# EAGLE design Adafruit NeoKey CHOC Socket Breakout (EAGLE 9.6.2)
COMPANY: ADAFRUIT INDUSTRIES; DRAWN: KTOWN; REV: A
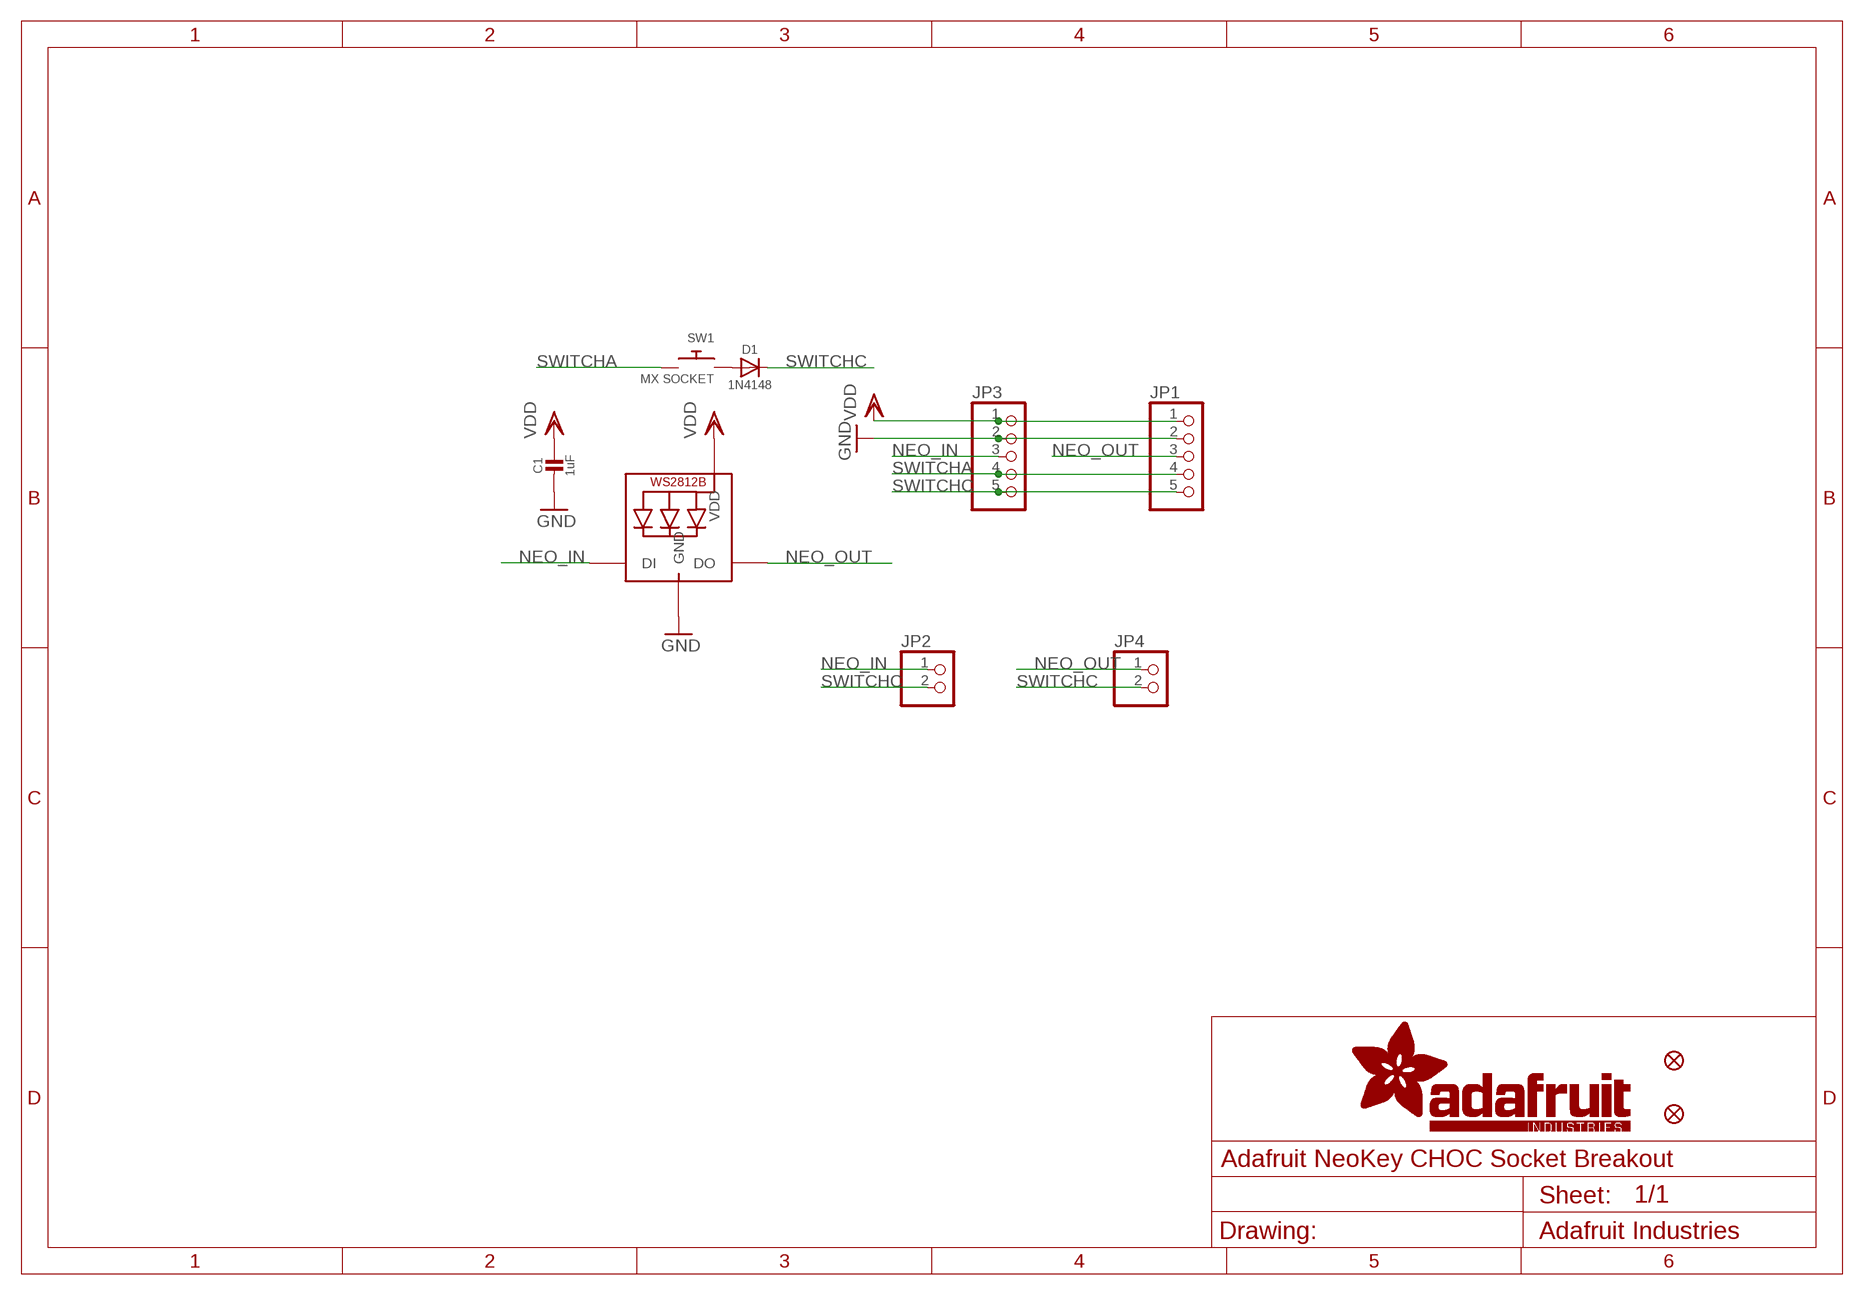
[diagram p0: schematic, sheet 1]

## Parts
C1  1uF  CAP_CERAMIC0603_NO  [0603-NO]
D1  1N4148  DIODESOD-323  [SOD-323]
FID3  FIDUCIAL_1MM  [FIDUCIAL_1MM]
FID4  FIDUCIAL_1MM  [FIDUCIAL_1MM]
JP1  HEADER-1X570MIL  [1X05_ROUND_70]
JP2  HEADER-1X2ROUND  [1X02_ROUND]
JP3  HEADER-1X570MIL  [1X05_ROUND_70]
JP4  HEADER-1X2ROUND  [1X02_ROUND]
LED1  WS2812B_SK6812E  [NEO3535_REVERSE]
SW1  MX SOCKET  SWITCH_PUSHBUTTON_CHOCSOCKET  [KAILH_CHOC_SOCKET]

## Nets
GND: C1.2 JP1.2 JP3.2 LED1.3-GND(GND)
N$2: D1.A SW1.1
NEO_IN: JP2.1 JP3.3 LED1.4-DIN(DI)
NEO_OUT: JP1.3 JP4.1 LED1.2-DOUT(DO)
SWITCHA: JP1.4 JP3.4 SW1.2
SWITCHC: D1.C JP1.5 JP2.2 JP3.5 JP4.2
VDD: C1.1 JP1.1 JP3.1 LED1.1-VDD(VDD)

## Library data of the parts
C1 = microbuilder:CAP_CERAMIC: Ceramic Capacitors For new designs, use the packages preceded by an '_' character since they are more reliable: The following footprints should be used on most boards: _0402 - Standard footprint for regular board layouts _0603 - Standard footprint for regular board layouts _0805 - Standard footprint for regular board layouts _1206 - Standard footprint for regular board layouts For extremely tight-pitch boards where space is at a premium, the following 'micro-pitch' footprints can be used (smaller pads, no silkscreen outline, etc.): _0402MP - Micro-pitch footprint for very dense/compact boards _0603MP - Micro-pitch footprint for very dense/compact boards _0805MP - Micro-pitch footprint for very dense/compact boards _1206MP - Micro-pitch footprint for very dense/compact boards
D1 = microbuilder:DIODE: Diode SMA Model Volts Amps Type Vf Ir Digikey # Notes SSA34-E3 40V 3A Schottky 480mV @ 3A 200uA @ 40V SSA34-E3/61TGITR-ND CDBA120-G 20V 1A Schottky 500mV @ 1A 500uA @ 20V 641-1014-6-ND REEL MBRA210 10V 2A Schottky 350mV @ 2A 700uA @ 10V MBRA210LT3 SOD-123 Model Volts Amps Type Vf Ir Order # Notes BAT54T1G 30V 200mA Schottky 800mV @ 200mA 2uA @ 25V BAT54T1GOSTR-ND B0530W 30V 500mA Schottky 430mV @ 500mA 130uA @ 30V B0530W-FDICT-ND REEL MBR120 20V 1A Schottky 340mV @ 1A MBR120VLSFT1GOSCT-ND SOD-323 Model Volts Amps Type Vf Ir Order # Notes PMEG2005EJ 20V 500mA Schottky 355mV @ 500mA 568-4110-1-ND ZLLS410 10V 570mA Schottky 380mV @ 570mA ZLLS410CT-ND 1N4148WS 75V 150mA Silicon/Simple 1V 1N4148WSFSCT-ND REEL SOD-523 Model Volts Amps Type Vf Ir Order # Notes BAT54XV2 30V 200mA Schottky 0.8V @ 100mA BAT54XV2CT-ND TB751S 30V 30mA Schottky RB751S-40TE61CT-ND SOT23-R/W (R = Solder Paste/Reflow Ovens, W = Hand-Soldering) Model Volts Amps Type Vf Ir Order # Notes BAT54FILM 40V 300mA Schottky 497-7162-1-ND POWERDI-5 Model Volts Amps Type Vf Ir Order # Notes PDS560 60V 5A Schottky 670mV @ 5A 150uA @ 60V PDS560DICT-ND
FID3 FID4 = microbuilder:FIDUCIAL: Fiducial Alignment Points Various fiducial points for machine vision alignment.; BOM: EXCLUDE
JP1 JP3 = microbuilder:HEADER-1X5: PIN HEADER
JP2 JP4 = microbuilder:HEADER-1X2: PIN HEADER
LED1 = microbuilder:WS2812B
SW1 = adafruit_electromech:SWITCH_PUSHBUTTON: Buttons SOFTTOUCHSMD_SJ - Soft touch temporary push button (Super Junk Akihabara) Compatible with SKPMANE010 [Mouser: 688-SKPMAN] C&K_KSS = Digikey: KSS221GLFS

## Net classes
1 highpower: width 0.305 mm, drill 0.483 mm
2 lowpower: width 0.254 mm, drill 0.483 mm

## Board
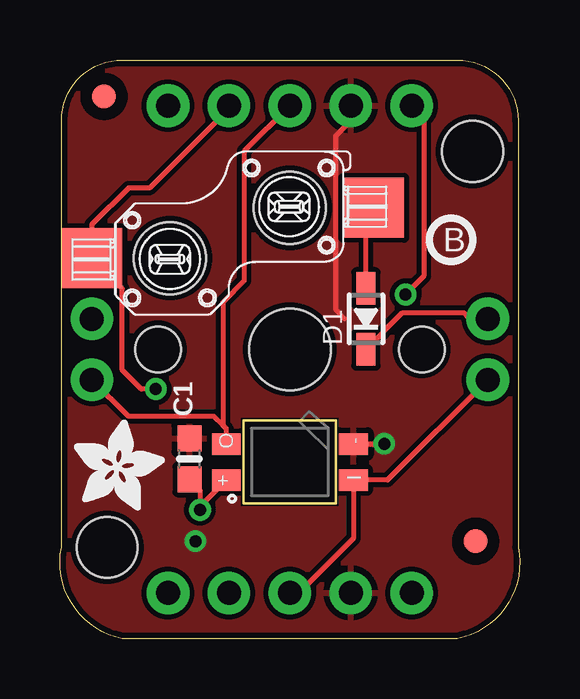
[diagram p1: board, top side]
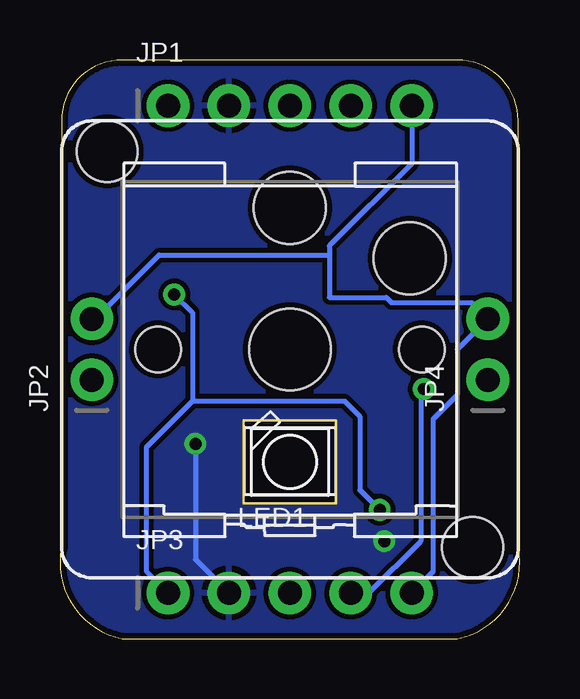
[diagram p2: board, bottom side, seen from below]

Size 19.18 x 24.13 mm. Coordinates in mm from the lower left corner, seen from the top.
Outline: 19.11,21.59 19.11,3.81 arc-90 16.57,0 2.6,0 arc-90 0.06,3.81 0.06,21.59 arc-90 2.6,24.13 16.57,24.13 arc-90 19.11,21.59
Copper layers (1*16): Top 0.035mm / dielectric 1.5mm / Bottom 0.035mm
Design rules "adafruit *": minimum track width 8mil, minimum drill 15.5mil, track to track 8mil, track to pad 8mil, pad to pad 8mil, via to via 8mil, smd to smd 8mil, copper to edge 10mil, drill to drill 8mil, minimum pad ring 10mil, minimum via ring 8mil, stop-mask expansion 2mil, vias tented up to drill 20mil, thermal gap 10mil
Holes 2.54 mm at 17.21,20.32 1.97,3.81

### Footprints (pad centres in the part's own frame; a part is rotated, then mirrored left to right if it is on the bottom)
0603-NO = smd 1.075 x 1: 1 -0.85,0; 2 0.85,0
SOD-323 = smd 1.35 x 0.8: A 1.27,0; C -1.27,0
FIDUCIAL_1MM = smd 1 x 1: 1 0,0
1X05_ROUND_70 = drill 1 pad 1.778: 1 -5.08,0; 2 -2.54,0; 3 0,0; 4 2.54,0; 5 5.08,0
1X02_ROUND = drill 1 pad 1.778: 1 -1.27,0; 2 1.27,0
NEO3535_REVERSE = smd 1.2 x 0.9 bottom: 1-VDD 2.65,-0.75; 2-DOUT 2.65,0.75; 3-GND -2.65,0.75; 4-DIN -2.65,-0.75
KAILH_CHOC_SOCKET = smd 2.55 x 2.5 bottom: 1 -3.49,5.9; 2 8.26,3.8 | hole 3.4: 0,0 | hole 3: 0,5.9; 5,3.8 | hole 1.9: 5.5,0; -5.5,0

### Placement (x,y rotation side)
C1  5.4,7.49 90 top
D1  12.76,13.34 90 top
FID3  17.33,4.06 0 top
FID4  1.84,22.61 0 top
JP1  9.59,22.22 0 bottom
JP2  17.84,12.07 90 bottom
JP3  9.59,1.91 0 bottom
JP4  1.33,12.07 90 bottom
LED1  9.59,7.37 0 bottom
PLABEL0  [PLABEL0]  14.67,4.34 90 top
PLABEL1  [PLABEL1]  2.73,12.57 0 top
PLABEL2  [PLABEL2]  16.35,13.34 0 top
PLABEL3  [PLABEL3]  3.87,10.29 0 top
PLABEL4  [PLABEL4]  16.06,10.54 0 top
PLABEL5  [PLABEL5]  10.48,9.91 0 top
PLABEL6  [PLABEL6]  12.13,3.43 90 top
PLABEL7  [PLABEL7]  9.59,3.58 90 top
PLABEL8  [PLABEL8]  7.05,3.84 90 top
PLABEL9  [PLABEL9]  4.38,3.74 90 top
PLABEL10  [PLABEL10]  4.51,0.6 90 bottom
PLABEL11  [PLABEL11]  4.51,23.59 90 bottom
PLABEL12  [PLABEL12]  7.05,23.59 90 bottom
PLABEL13  [PLABEL13]  6.85,0.64 90 bottom
PLABEL14  [PLABEL14]  9.59,0.54 90 bottom
PLABEL15  [PLABEL15]  9.59,23.59 90 bottom
PLABEL16  [PLABEL16]  11.93,23.59 90 bottom
PLABEL17  [PLABEL17]  11.93,0.54 90 bottom
PLABEL18  [PLABEL18]  14.57,23.59 90 bottom
PLABEL19  [PLABEL19]  14.67,0.54 90 bottom
PLABEL20  [PLABEL0]  14.92,19.59 90 top
PLABEL21  [PLABEL6]  12.13,20.7 90 top
PLABEL22  [PLABEL8]  6.95,20.7 0 top
PLABEL23  [PLABEL9]  4.56,20.57 0 top
PLABEL200  [PLABEL200]  13.78,7.87 0 top
SW1  9.59,12.07 0 bottom
U$1  [PCBFEAT-REV-040]  16.32,16.64 0 top
U$2  [ADAFRUIT_3.5MM]  0.57,5.33 0 top

### Tracks (layer width: path | path; a pad name or v marks a point on that pad's centre or on a via)
GND  (via drill 0.5)
  Top 0.203: LED1.3-GND v13.52,8.13 | JP1.2 12.13,21.59 11.49,20.95 11.49,13.72 11.87,13.34
  Bottom 0.203: v13.52,8.13 13.52,3.3 JP3.2
  other vias: 5.65,4.06
  pour Top: 19.11,24.13 0.06,24.13 0.06,0 19.11,0
  pour Bottom: 19.11,24.13 0.06,24.13 0.06,0 19.11,0
N$2
  Top 0.203: D1.A 12.76,18.52 12.21,17.96 SW1.1
NEO_IN
  Top 0.203: JP2.1 13.66,6.62 LED1.4-DIN 12.24,4.17 9.97,1.91 JP3.3
NEO_OUT
  Top 0.203: LED1.2-DOUT 6.94,8.75 6.79,8.89 | JP4.1 2.86,9.27 6.41,9.27 6.79,8.89 | JP1.3 7.68,20.32 7.68,14.92 6.79,14.03 6.79,8.89
SWITCHA  (via drill 0.5)
  Top 0.203: JP1.4 7.05,22.1 3.75,18.8 2.86,18.8 1.33,17.27 SW1.2 2.6,14.59 2.6,11.2 3.39,10.41 v4,10.41
  Bottom 0.203: JP3.4 6.29,1.91 4.13,4.06 4.13,10.28 v4,10.41
SWITCHC
  Top 0.203: D1.C 14.29,13.59 16.83,13.59 17.08,13.34 JP2.2
  Bottom 0.203: JP3.5 3.62,2.79 3.62,9.14 2.6,10.16 2.6,12.07 JP4.2 2.01,14.01 5.36,14.01 5.57,14.22 7.94,14.22 7.94,16 | JP2.2 17.72,13.34 15.05,16 7.94,16 | JP1.5 4.51,19.81 7.94,16.38 7.94,16
VDD  (via drill 0.5)
  Top 0.203: LED1.1-VDD 5.84,5.52 v5.84,5.37 5.84,6.2 C1.1 | JP1.1 15.18,21.72 15.18,15.11 v14.41,14.35
  Bottom 0.203: JP3.1 15.56,2.79 15.56,8 13.65,9.91 | 13.65,9.91 7.3,9.91 6.67,9.27 6.67,6.2 v5.84,5.37 | v14.41,14.35 13.65,13.59 13.65,9.91

### Text on the board
Pinguin_tBackup: NeoKey | CHOC | C | C | OUT | IN | S- | S+ | VDD | IN | G
Pinguin_bBackup: C | A | O | - | + | C | A | I | - | +